# Altium project altium-practice-macropad.PrjPcb
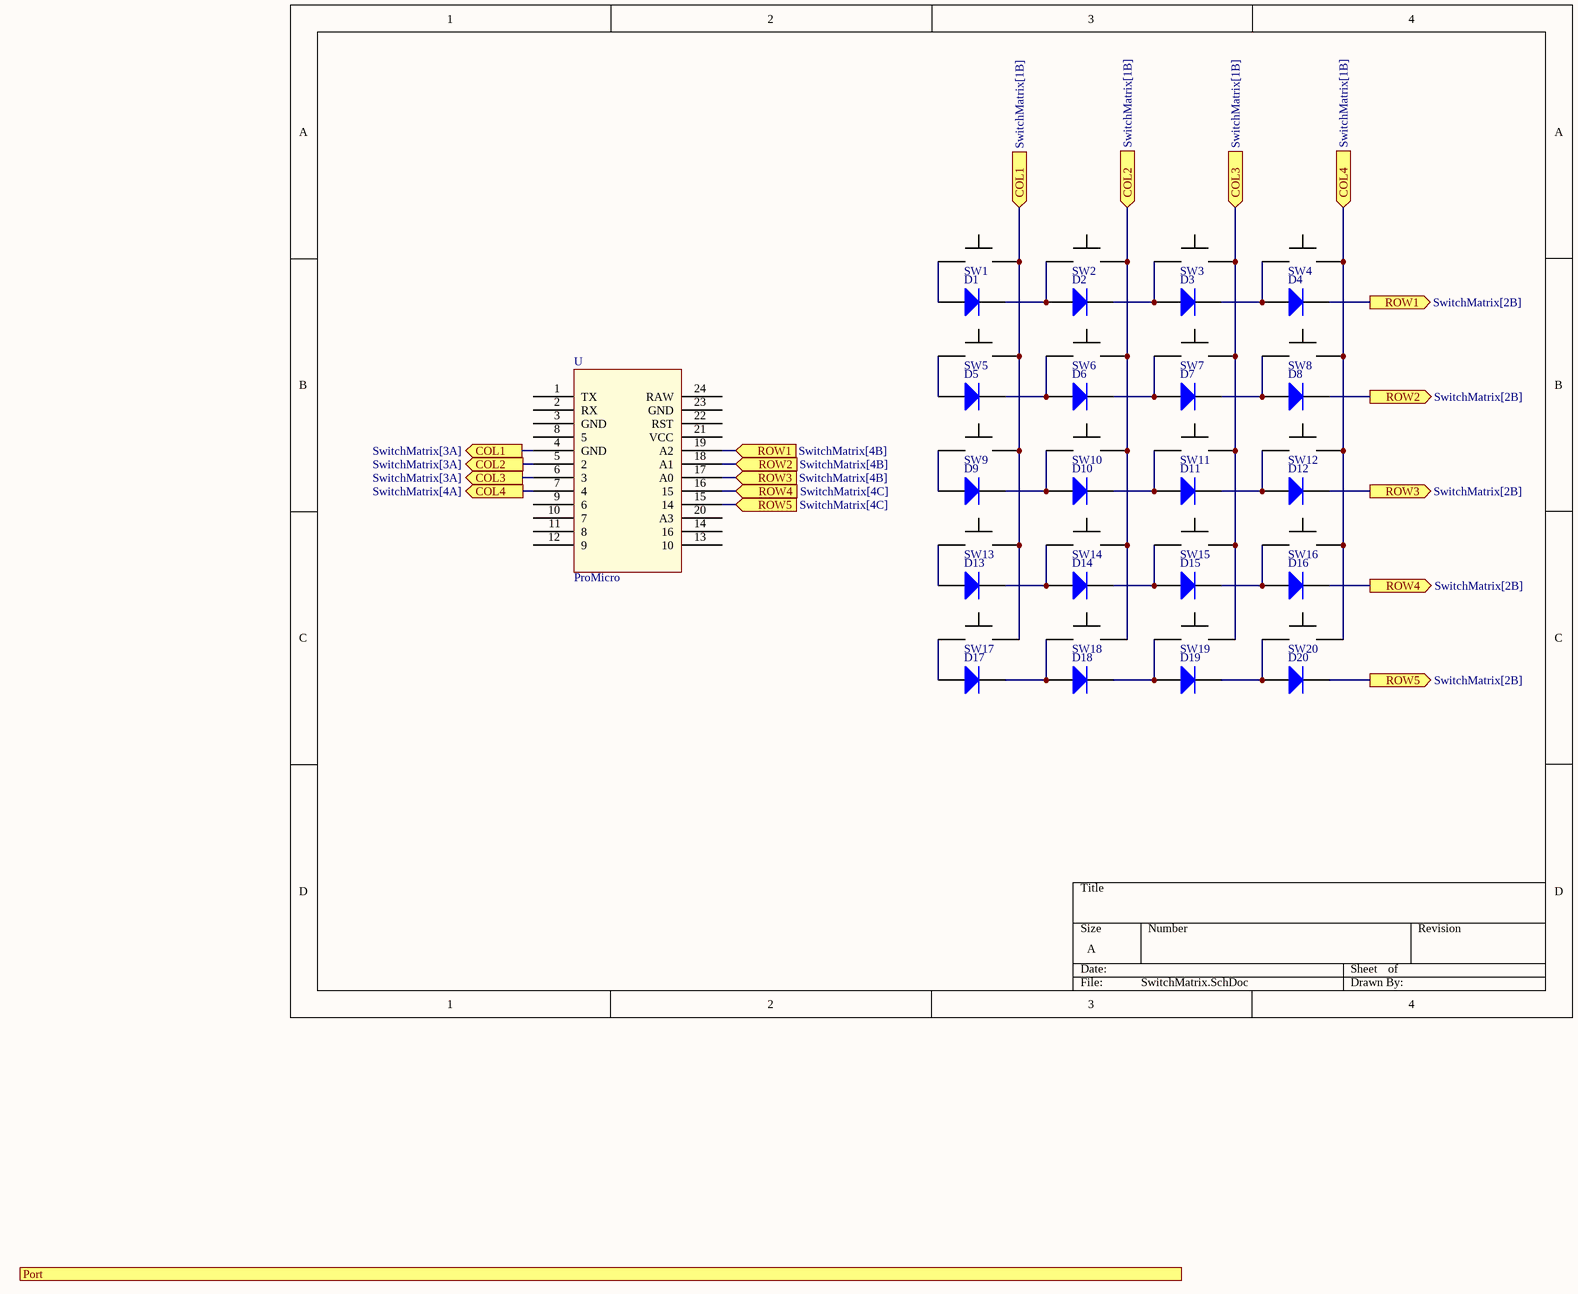
[diagram p0: SwitchMatrix.SchDoc]
1 sheet, 41 parts. Net scope: flat (ports and power ports of the same name join across sheets).
Board file: macropad.PcbDoc

## Sheet SwitchMatrix.SchDoc
size A; SheetNumber: 1; SheetTotal: 1

### Parts
D1  Diode  (value not drawn)
D2  Diode  (value not drawn)
D3  Diode  (value not drawn)
D4  Diode  (value not drawn)
D5  Diode  (value not drawn)
D6  Diode  (value not drawn)
D7  Diode  (value not drawn)
D8  Diode  (value not drawn)
D9  Diode  (value not drawn)
D10  Diode  (value not drawn)
D11  Diode  (value not drawn)
D12  Diode  (value not drawn)
D13  Diode  (value not drawn)
D14  Diode  (value not drawn)
D15  Diode  (value not drawn)
D16  Diode  (value not drawn)
D17  Diode  (value not drawn)
D18  Diode  (value not drawn)
D19  Diode  (value not drawn)
D20  Diode  (value not drawn)
SW1  PG1350 SW  [PG1350]  (value not drawn)
SW2  PG1350 SW  [PG1350]  (value not drawn)
SW3  PG1350 SW  [PG1350]  (value not drawn)
SW4  PG1350 SW  [PG1350]  (value not drawn)
SW5  PG1350 SW  [PG1350]  (value not drawn)
SW6  PG1350 SW  [PG1350]  (value not drawn)
SW7  PG1350 SW  [PG1350]  (value not drawn)
SW8  PG1350 SW  [PG1350]  (value not drawn)
SW9  PG1350 SW  [PG1350]  (value not drawn)
SW10  PG1350 SW  [PG1350]  (value not drawn)
SW11  PG1350 SW  [PG1350]  (value not drawn)
SW12  PG1350 SW  [PG1350]  (value not drawn)
SW13  PG1350 SW  [PG1350]  (value not drawn)
SW14  PG1350 SW  [PG1350]  (value not drawn)
SW15  PG1350 SW  [PG1350]  (value not drawn)
SW16  PG1350 SW  [PG1350]  (value not drawn)
SW17  PG1350 SW  [PG1350]  (value not drawn)
SW18  PG1350 SW  [PG1350]  (value not drawn)
SW19  PG1350 SW  [PG1350]  (value not drawn)
SW20  PG1350 SW  [PG1350]  (value not drawn)
U  ProMicro  [ProMicroHeaders]

### Ports
COL1 (in, see SwitchMatrix[1B]), COL1 (out, see SwitchMatrix[3A]), COL2 (in, see SwitchMatrix[1B]), COL2 (out, see SwitchMatrix[3A]), COL3 (in, see SwitchMatrix[1B]), COL3 (out, see SwitchMatrix[3A]), COL4 (in, see SwitchMatrix[1B]), COL4 (out, see SwitchMatrix[4A]), Port, ROW1 (in, see SwitchMatrix[4B]), ROW1 (out, see SwitchMatrix[2B]), ROW2 (in, see SwitchMatrix[4B]), ROW2 (out, see SwitchMatrix[2B]), ROW3 (in, see SwitchMatrix[4B]), ROW3 (out, see SwitchMatrix[2B]), ROW4 (in, see SwitchMatrix[4C]), ROW4 (out, see SwitchMatrix[2B]), ROW5 (in, see SwitchMatrix[4C]), ROW5 (out, see SwitchMatrix[2B])

### Nets
NetD1_1: D1.1(A) SW1.1
NetD1_2: D1.2(K) D2.1(A) SW2.1
NetD2_2: D2.2(K) D3.1(A) SW3.1
NetD3_2: D3.2(K) D4.1(A) SW4.1
NetD4_2: D4.2(K) U.19(A2) ; port ROW1
NetD5_1: D5.1(A) SW5.1
NetD5_2: D5.2(K) D6.1(A) SW6.1
NetD6_2: D6.2(K) D7.1(A) SW7.1
NetD7_2: D7.2(K) D8.1(A) SW8.1
NetD8_2: D8.2(K) U.18(A1) ; port ROW2
NetD9_1: D9.1(A) SW9.1
NetD9_2: D9.2(K) D10.1(A) SW10.1
NetD10_2: D10.2(K) D11.1(A) SW11.1
NetD11_2: D11.2(K) D12.1(A) SW12.1
NetD12_2: D12.2(K) U.17(A0) ; port ROW3
NetD13_1: D13.1(A) SW13.1
NetD13_2: D13.2(K) D14.1(A) SW14.1
NetD14_2: D14.2(K) D15.1(A) SW15.1
NetD15_2: D15.2(K) D16.1(A) SW16.1
NetD16_2: D16.2(K) U.16(15) ; port ROW4
NetD17_1: D17.1(A) SW17.1
NetD17_2: D17.2(K) D18.1(A) SW18.1
NetD18_2: D18.2(K) D19.1(A) SW19.1
NetD19_2: D19.2(K) D20.1(A) SW20.1
NetD20_2: D20.2(K) U.15(14) ; port ROW5
NetSW1_2: SW1.2 SW5.2 SW9.2 SW13.2 SW17.2 U.4(GND) ; port COL1
NetSW2_2: SW2.2 SW6.2 SW10.2 SW14.2 SW18.2 U.5(2) ; port COL2
NetSW3_2: SW3.2 SW7.2 SW11.2 SW15.2 SW19.2 U.6(3) ; port COL3
NetSW4_2: SW4.2 SW8.2 SW12.2 SW16.2 SW20.2 U.7(4) ; port COL4

Not connected (* = marked no-connect by the designer): U 1(TX) 2(RX) 3(GND) 8(5) 9(6) 10(7) 11(8) 12(9) 13(10) 14(16) 20(A3) 21(VCC) 22(RST) 23(GND) 24(RAW)

### Library data of the parts
D1-D20 = Diode: AF: 1; BV: 0; BV_MAX: 1e99; EG: 1.11; FC: 0.5; IBV: 0.001; ISR: 1e-14; MJSW: 0.33; NTUN: 30; TNOM: 27; XTI: 3; SimulationGenericComponent: True; CJO: 0; CJP: 0; CTA: 0; CTP: 0; FCS: 0.5; FV_MAX: 1e99; IKF: 0; IKR: 0; JSW: 0; JTUN: 0; JTUNSW: 0; KEG: 1; KF: 0; LEVEL: 1; N: 1; NBV: 1; NR: 1; NS: 1; PHP: 1; RS: 0; TCV: 0; TLEV: 0; TLEVC: 0; TM1: 0; TM2: 0; TPB: 0; TPHP: 0; TRS: 0; TRS2: 0; TT: 0; TTT1: 0; TTT2: 0; VJ: 1; XTITUN: 3; IS: 1e-14